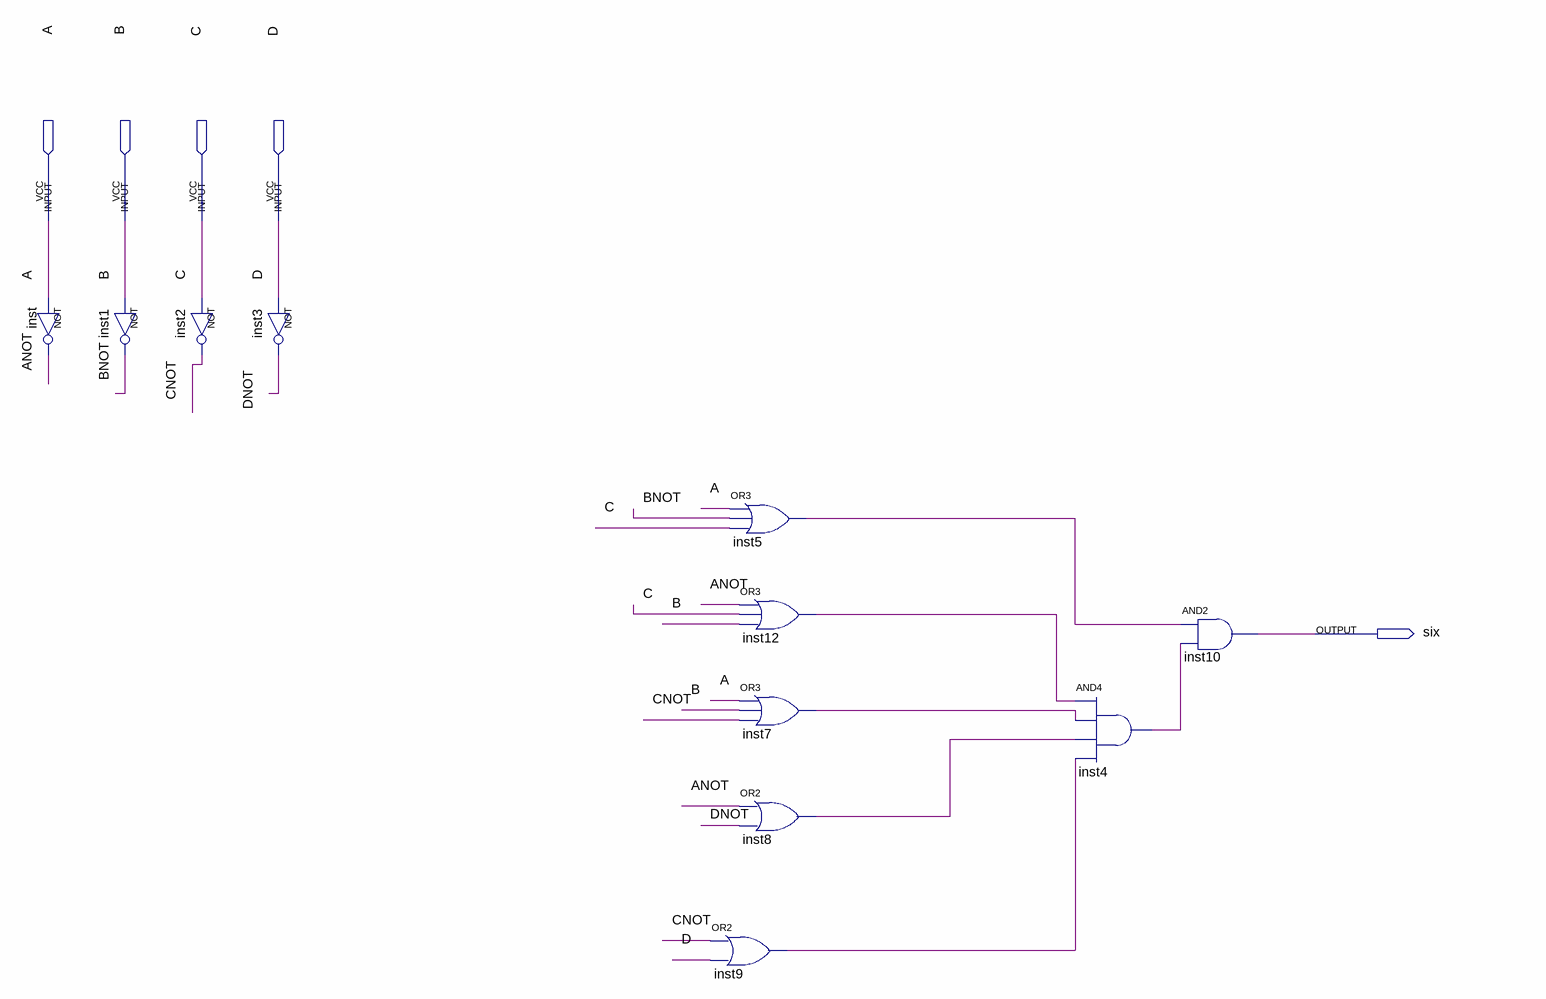
[diagram p0: schematic sheet]
// Quartus schematic output6.bdf as structural Verilog: 11 symbols, 5 pins
module output6 (
  input  A,
  input  B,
  input  C,
  input  D,
  output six
);

  wire ANOT, BNOT, CNOT, DNOT, inst4_out, inst5_out, inst7_out, inst8_out, inst9_out, inst12_out;

  not inst (ANOT, A);
  not inst1 (BNOT, B);
  not inst2 (CNOT, C);
  not inst3 (DNOT, D);
  or inst5 (inst5_out, A, BNOT, C);
  or inst12 (inst12_out, ANOT, C, B);
  or inst7 (inst7_out, A, B, CNOT);
  or inst8 (inst8_out, ANOT, DNOT);
  or inst9 (inst9_out, CNOT, D);
  and inst4 (inst4_out, inst12_out, inst7_out, inst8_out, inst9_out);
  and inst10 (six, inst5_out, inst4_out);
endmodule
